# EAGLE design Clock Display (EAGLE 9.6.2)
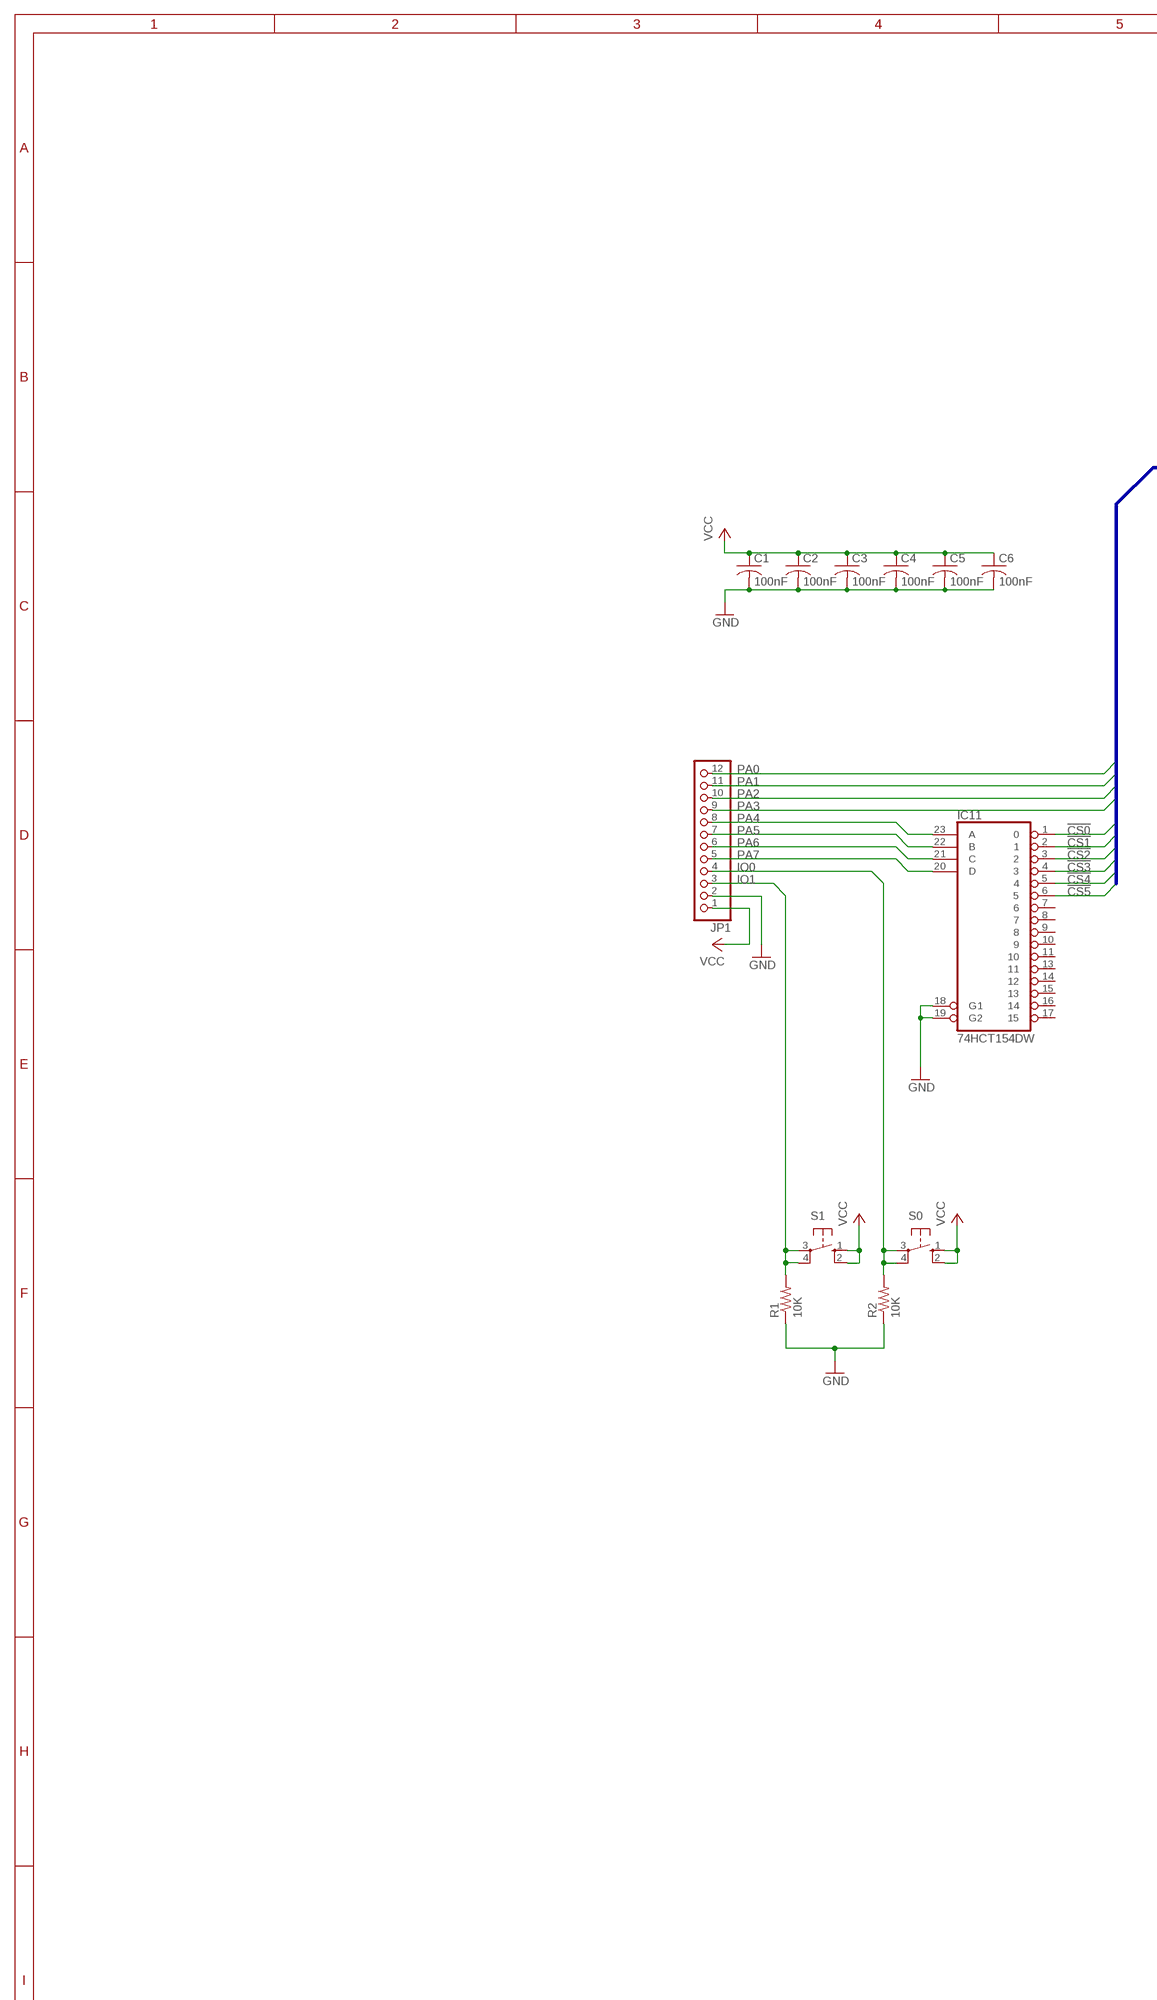
[diagram p0: schematic, sheet 1, part 1 of 2]
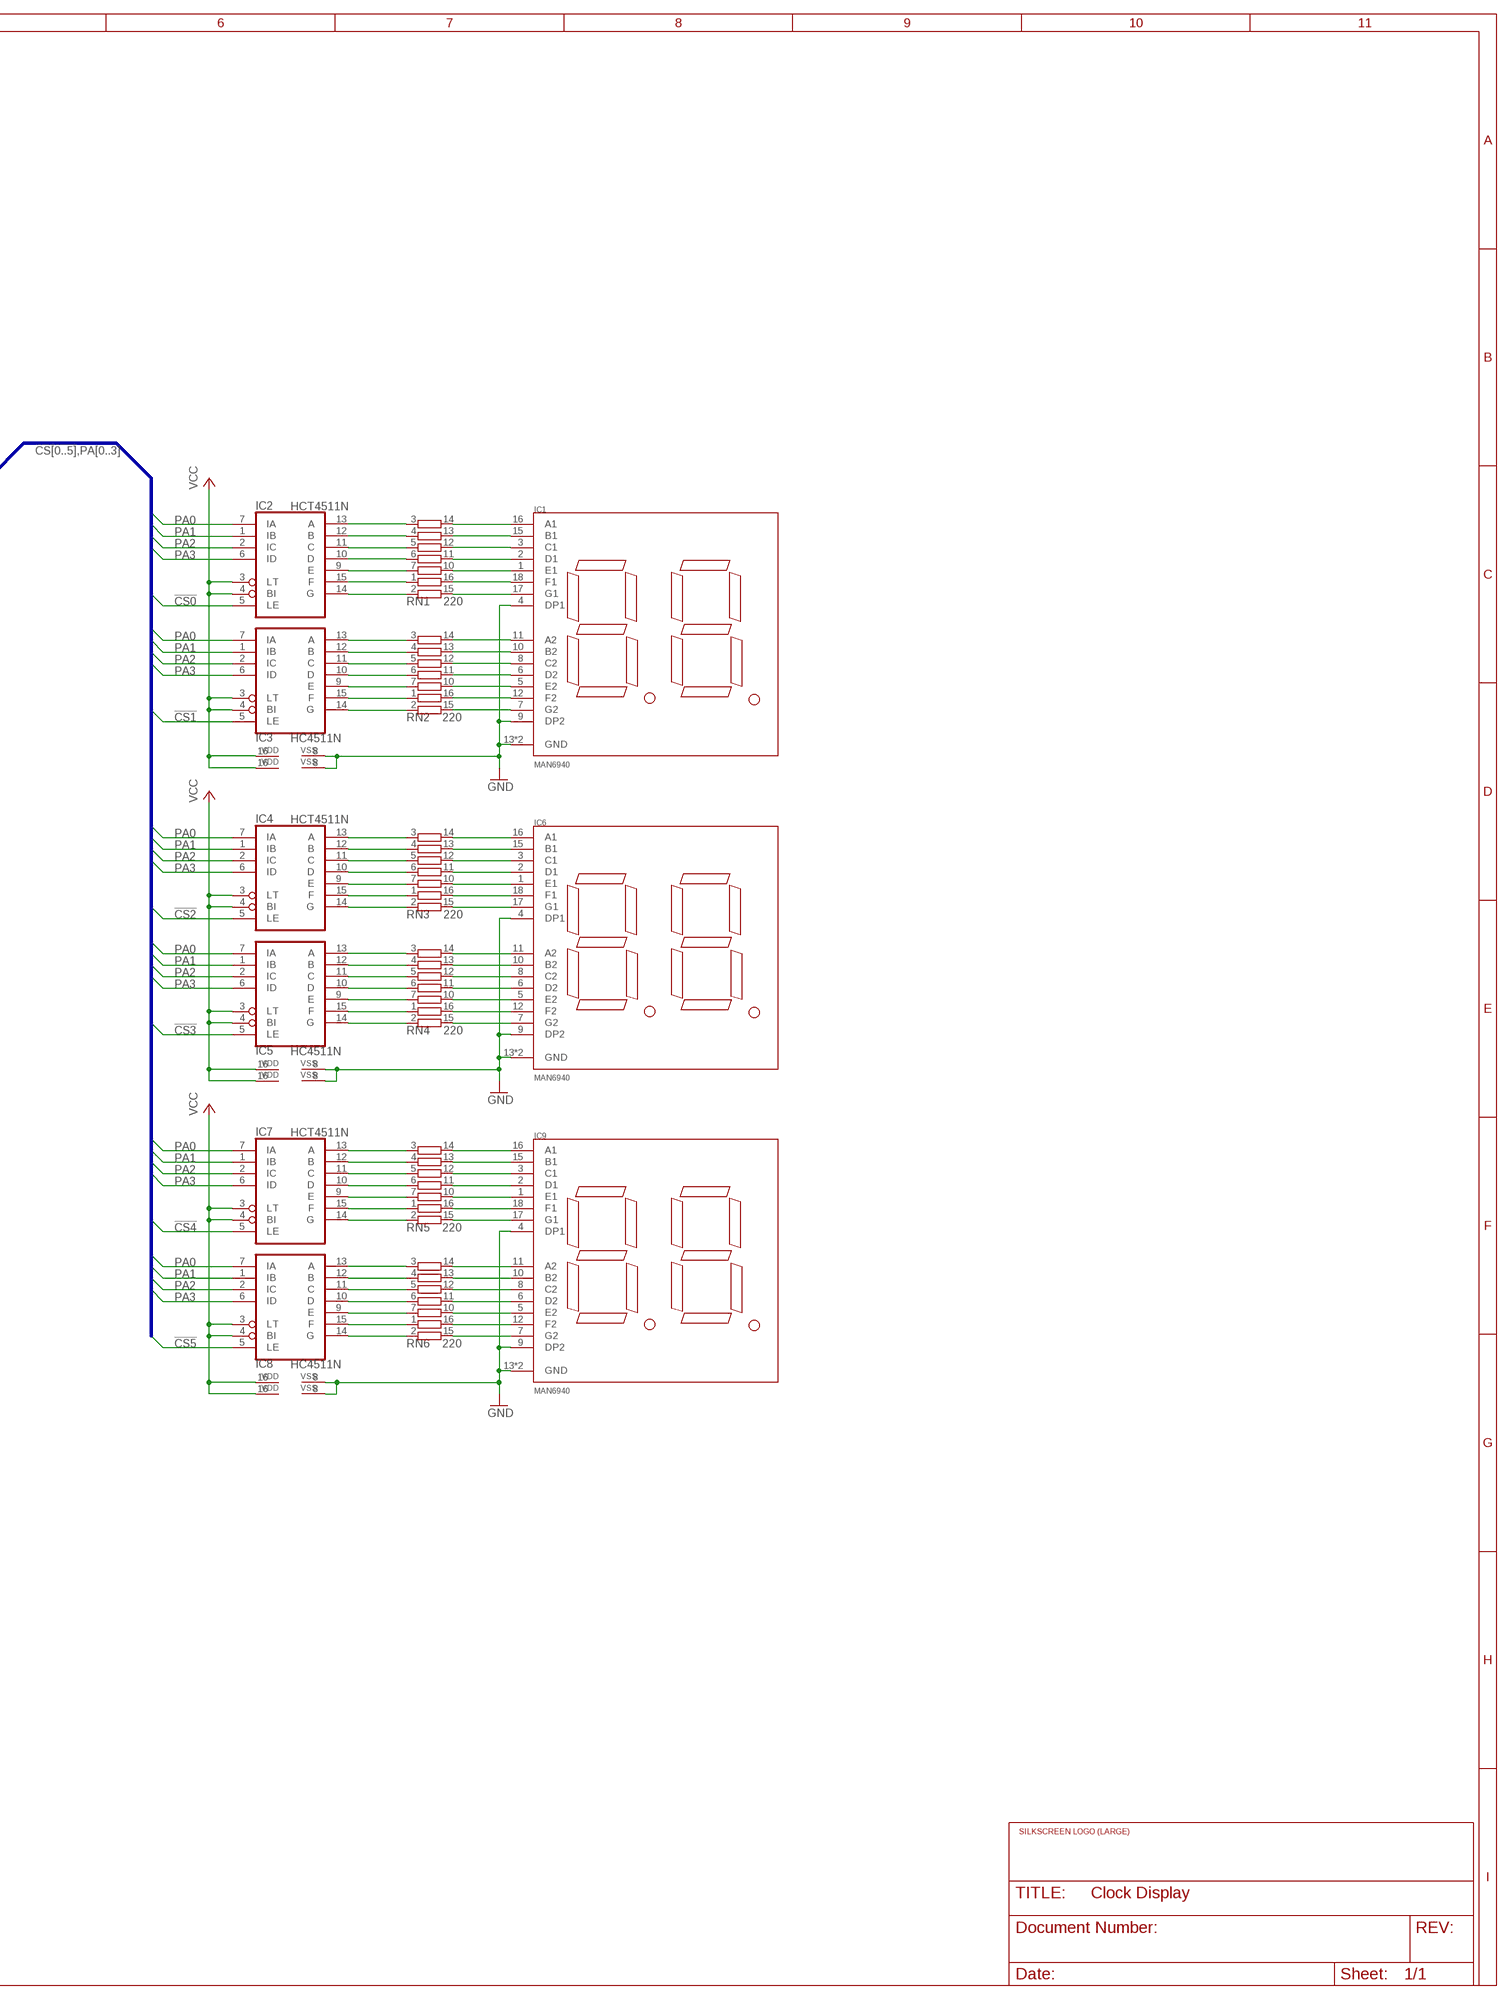
[diagram p1: schematic, sheet 1, part 2 of 2]

## Parts
C1  100nF  C-USC0805  [C0805]
C2  100nF  C-USC0805  [C0805]
C3  100nF  C-USC0805  [C0805]
C4  100nF  C-USC0805  [C0805]
C5  100nF  C-USC0805  [C0805]
C6  100nF  C-USC0805  [C0805]
IC1  MAN6940  [MAN6940]
IC2  HCT4511N  4511D  [SO16]
IC3  HC4511N  4511D  [SO16]
IC4  HCT4511N  4511D  [SO16]
IC5  HC4511N  4511D  [SO16]
IC6  MAN6940  [MAN6940]
IC7  HCT4511N  4511D  [SO16]
IC8  HC4511N  4511D  [SO16]
IC9  MAN6940  [MAN6940]
IC11  74HCT154DW  [SO24W]
JP1  PINHD-1X12-CB  [1X12-CB]
R1  10K  R-US_R0805  [R0805]
R2  10K  R-US_R0805  [R0805]
RN1  220  8R-NSOMC  [SOMC16]
RN2  220  8R-NSOMC  [SOMC16]
RN3  220  8R-NSOMC  [SOMC16]
RN4  220  8R-NSOMC  [SOMC16]
RN5  220  8R-NSOMC  [SOMC16]
RN6  220  8R-NSOMC  [SOMC16]
S0  10-XX  [B3F-10XX]
S1  10-XX  [B3F-10XX]
U$1  LOGO_LARGE  [LOGO_LARGE]

## Nets
!CS0: IC2.5(LE) IC11.1
!CS1: IC3.5(LE) IC11.2
!CS2: IC4.5(LE) IC11.3
!CS3: IC5.5(LE) IC11.4
!CS4: IC7.5(LE) IC11.5
!CS5: IC8.5(LE) IC11.6
GND: C1.2 C2.2 C3.2 C4.2 C5.2 C6.2 IC1.4(DP1) IC1.9(DP2) IC1.13(GND) IC1.14(GND) IC2.8(VSS) IC3.8(VSS) IC4.8(VSS) IC5.8(VSS) IC6.4(DP1) IC6.9(DP2) IC6.13(GND) IC6.14(GND) IC7.8(VSS) IC8.8(VSS) IC9.4(DP1) IC9.9(DP2) IC9.13(GND) IC9.14(GND) IC11.18(G1) IC11.19(G2) JP1.2 R1.1 R2.1
IO0: JP1.4 R2.2 S0.3(P) S0.4(P1)
IO1: JP1.3 R1.2 S1.3(P) S1.4(P1)
N$1: IC2.13(A) RN1.3
N$2: IC2.12(B) RN1.4
N$3: IC2.11(C) RN1.5
N$4: IC2.10(D) RN1.6
N$5: IC2.9(E) RN1.7
N$6: IC2.15(F) RN1.1
N$7: IC2.14(G) RN1.2
N$8: IC3.13(A) RN2.3
N$9: IC3.12(B) RN2.4
N$10: IC3.11(C) RN2.5
N$11: IC3.10(D) RN2.6
N$12: IC3.9(E) RN2.7
N$13: IC3.15(F) RN2.1
N$14: IC3.14(G) RN2.2
N$15: IC1.7(G2) RN2.15
N$16: IC1.12(F2) RN2.16
N$17: IC1.5(E2) RN2.10
N$18: IC1.6(D2) RN2.11
N$19: IC1.8(C2) RN2.12
N$20: IC1.10(B2) RN2.13
N$21: IC1.11(A2) RN2.14
N$22: IC1.17(G1) RN1.15
N$23: IC1.18(F1) RN1.16
N$24: IC1.1(E1) RN1.10
N$25: IC1.3(C1) RN1.12
N$26: IC1.2(D1) RN1.11
N$27: IC1.15(B1) RN1.13
N$28: IC1.16(A1) RN1.14
N$29: IC6.16(A1) RN3.14
N$30: IC6.15(B1) RN3.13
N$31: IC6.3(C1) RN3.12
N$32: IC6.2(D1) RN3.11
N$33: IC6.1(E1) RN3.10
N$34: IC6.18(F1) RN3.16
N$35: IC6.17(G1) RN3.15
N$36: IC6.11(A2) RN4.14
N$37: IC6.10(B2) RN4.13
N$38: IC6.8(C2) RN4.12
N$39: IC6.6(D2) RN4.11
N$40: IC6.5(E2) RN4.10
N$41: IC6.12(F2) RN4.16
N$42: IC6.7(G2) RN4.15
N$43: IC4.13(A) RN3.3
N$44: IC4.12(B) RN3.4
N$45: IC4.11(C) RN3.5
N$46: IC4.10(D) RN3.6
N$47: IC4.9(E) RN3.7
N$48: IC4.15(F) RN3.1
N$49: IC4.14(G) RN3.2
N$50: IC5.13(A) RN4.3
N$51: IC5.12(B) RN4.4
N$52: IC5.11(C) RN4.5
N$53: IC5.10(D) RN4.6
N$54: IC5.9(E) RN4.7
N$55: IC5.15(F) RN4.1
N$56: IC5.14(G) RN4.2
N$57: IC9.16(A1) RN5.14
N$58: IC9.15(B1) RN5.13
N$59: IC9.3(C1) RN5.12
N$60: IC9.2(D1) RN5.11
N$61: IC9.1(E1) RN5.10
N$62: IC9.18(F1) RN5.16
N$63: IC9.17(G1) RN5.15
N$64: IC9.11(A2) RN6.14
N$65: IC9.10(B2) RN6.13
N$66: IC9.8(C2) RN6.12
N$67: IC9.6(D2) RN6.11
N$68: IC9.5(E2) RN6.10
N$69: IC9.12(F2) RN6.16
N$70: IC9.7(G2) RN6.15
N$71: IC7.13(A) RN5.3
N$72: IC7.12(B) RN5.4
N$73: IC7.11(C) RN5.5
N$74: IC7.10(D) RN5.6
N$75: IC7.9(E) RN5.7
N$76: IC7.15(F) RN5.1
N$77: IC7.14(G) RN5.2
N$78: IC8.13(A) RN6.3
N$79: IC8.12(B) RN6.4
N$80: IC8.11(C) RN6.5
N$81: IC8.10(D) RN6.6
N$82: IC8.9(E) RN6.7
N$83: IC8.15(F) RN6.1
N$84: IC8.14(G) RN6.2
PA0: IC2.7(IA) IC3.7(IA) IC4.7(IA) IC5.7(IA) IC7.7(IA) IC8.7(IA) JP1.12
PA1: IC2.1(IB) IC3.1(IB) IC4.1(IB) IC5.1(IB) IC7.1(IB) IC8.1(IB) JP1.11
PA2: IC2.2(IC) IC3.2(IC) IC4.2(IC) IC5.2(IC) IC7.2(IC) IC8.2(IC) JP1.10
PA3: IC2.6(ID) IC3.6(ID) IC4.6(ID) IC5.6(ID) IC7.6(ID) IC8.6(ID) JP1.9
PA4: IC11.23(A) JP1.8
PA5: IC11.22(B) JP1.7
PA6: IC11.21(C) JP1.6
PA7: IC11.20(D) JP1.5
VCC: C1.1 C2.1 C3.1 C4.1 C5.1 C6.1 IC2.3(LT) IC2.4(BI) IC2.16(VDD) IC3.3(LT) IC3.4(BI) IC3.16(VDD) IC4.3(LT) IC4.4(BI) IC4.16(VDD) IC5.3(LT) IC5.4(BI) IC5.16(VDD) IC7.3(LT) IC7.4(BI) IC7.16(VDD) IC8.3(LT) IC8.4(BI) IC8.16(VDD) JP1.1 S0.1(S) S0.2(S1) S1.1(S) S1.2(S1)
Unconnected: IC11.7 IC11.8 IC11.9 IC11.10 IC11.11 IC11.13 IC11.14 IC11.15 IC11.16 IC11.17 RN1.8 RN1.9 RN2.8 RN2.9 RN3.8 RN3.9 RN4.8 RN4.9 RN5.8 RN5.9 RN6.8 RN6.9

## Buses
!CS[0..5],PA[0..3]

## Notes on the sheet
- RN1
- RN2
- RN3
- RN4
- RN5
- RN6

## Power pins joined to a net without a drawn wire
GND: IC11.12(GND)
VCC: IC11.24(VCC)

## Library data of the parts
C1-C6 = rcl:C-US: CAPACITOR, American symbol; SPICEPREFIX: C
IC1 IC6 IC9 = MAN6940:MAN6940: FAIRCHILD SEMICONDUCTOR: MAN6940 Double 7-Segment Display (Common Cathode)
IC2-IC5 IC7 IC8 = 45xx:4511: BCD to 7-segment LATCH/DECODER/DRIVER
IC11 = 74xx-eu:74*154: 4-line to 16-line data SELECTOR/MULTIPLEXER
JP1 = adafruit:PINHD-1X12: PIN HEADER
R1 R2 = rcl:R-US_: RESISTOR, American symbol; SPICEPREFIX: R
RN1-RN6 = resistor-dil:8R-N: DIL RESISTOR; OC_FARNELL: unknown; OC_NEWARK: unknown
S0 S1 = switch-omron:10-XX: OMRON SWITCH; MPN: B3F-1000; OC_FARNELL: 176432; OC_NEWARK: 36M3542
U$1 = Logo 2020:LOGO_LARGE

## Board
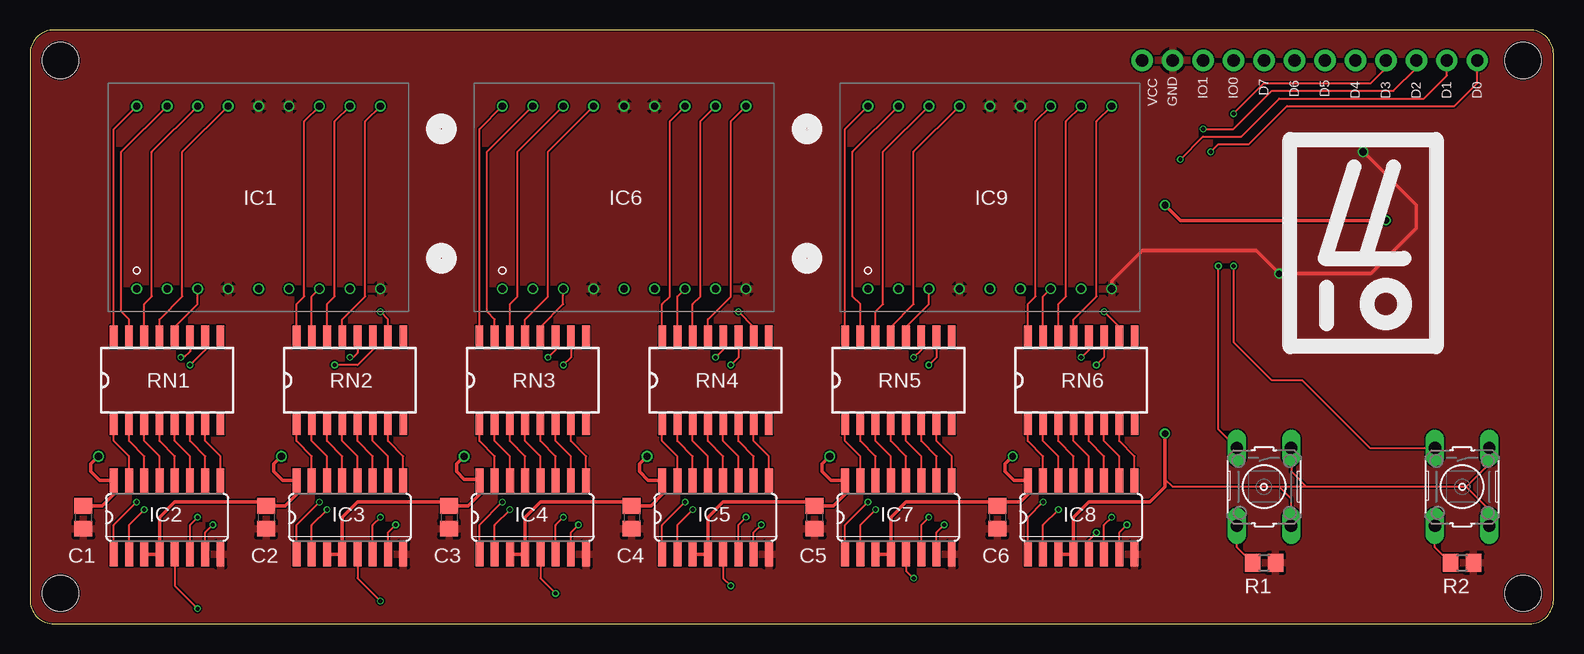
[diagram p2: board, top side]
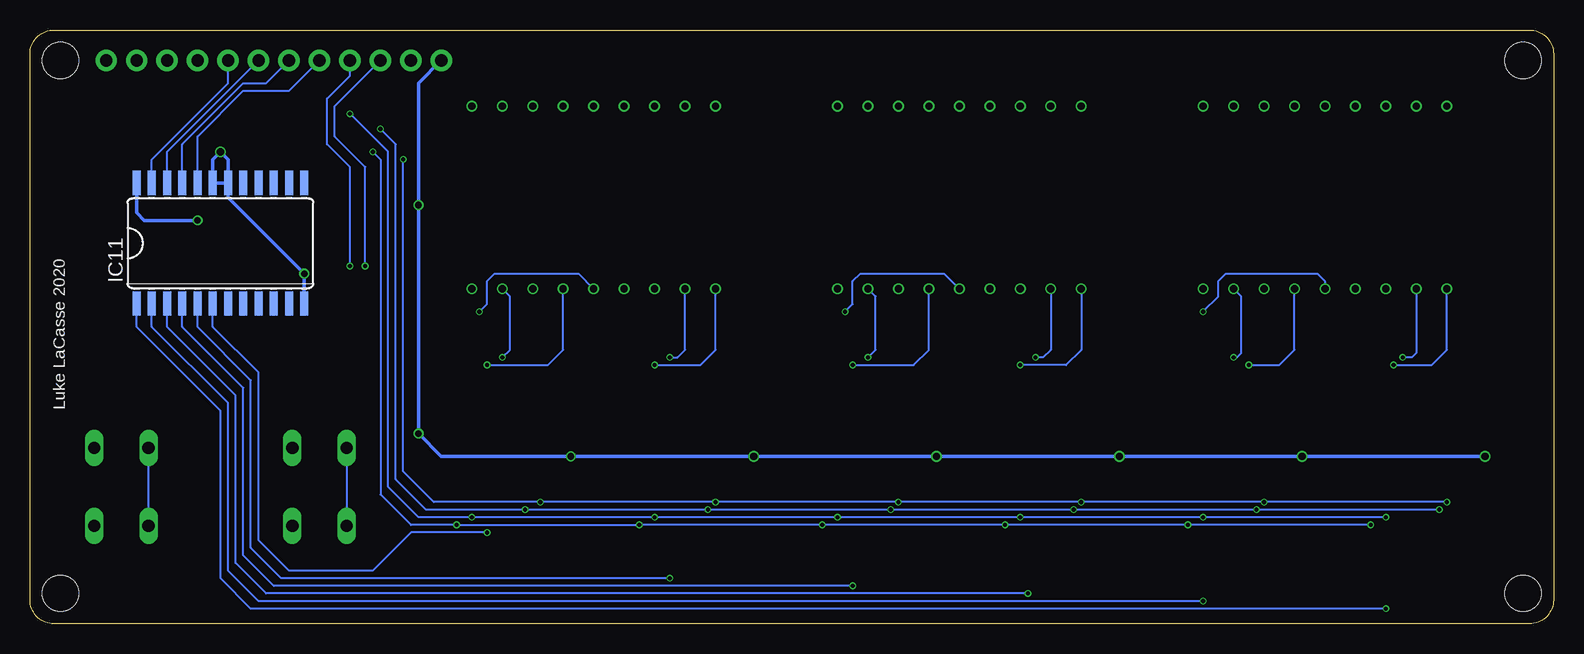
[diagram p3: board, bottom side, seen from below]

Size 127 x 49.53 mm. Coordinates in mm from the lower left corner, seen from the top.
Outline: 0,47.53 0,2 arc90 2,0 125,0 arc90 127,2 127,47.53 arc90 125,49.53 2,49.53 arc90 0,47.53
Copper layers (1*16): Top 0.035mm / dielectric 1.53mm / Bottom 0.035mm
Design rules "jlcpcb-2-layer(MINE)": minimum track width 5mil, minimum drill 0.2mm, track to track 5mil, track to pad 5mil, pad to pad 5mil, via to via 10mil, smd to smd 0mil, copper to edge 5mil, drill to drill 0.54mm, minimum pad ring 4mil, minimum via ring 4mil, stop-mask expansion 3mil, vias tented up to drill 100mil, thermal gap 10mil
Holes 3 mm at 2.54,46.99 2.54,2.54 124.46,2.54 124.46,46.99

### Footprints (pad centres in the part's own frame; a part is rotated, then mirrored left to right if it is on the bottom)
C0805 = smd 1.3 x 1.5: 1 -0.95,0; 2 0.95,0
MAN6940 = drill 0.6: 1 -10.16,-7.62; 2 -7.62,-7.62; 3 -5.08,-7.62; 4 -2.54,-7.62; 5 0,-7.62; 6 2.54,-7.62; 7 5.08,-7.62; 8 7.62,-7.62; 9 10.16,-7.62; 10 10.16,7.62; 11 7.62,7.62; 12 5.08,7.62; 13 2.54,7.62; 14 0,7.62; 15 -2.54,7.62; 16 -5.08,7.62; 17 -7.62,7.62; 18 -10.16,7.62
SO16 = smd 0.66 x 2.032: 1 -4.445,-3.073; 2 -3.175,-3.073; 3 -1.905,-3.073; 4 -0.635,-3.073; 5 0.635,-3.073; 6 1.905,-3.073; 7 3.175,-3.073; 8 4.445,-3.073; 9 4.445,3.073; 10 3.175,3.073; 11 1.905,3.073; 12 0.635,3.073; 13 -0.635,3.073; 14 -1.905,3.073; 15 -3.175,3.073; 16 -4.445,3.073
SO24W = smd 0.66 x 2.032: 1 -6.985,-5.029; 2 -5.715,-5.029; 3 -4.445,-5.029; 4 -3.175,-5.029; 5 -1.905,-5.029; 6 -0.635,-5.029; 7 0.635,-5.029; 8 1.905,-5.029; 9 3.175,-5.029; 10 4.445,-5.029; 11 5.715,-5.029; 12 6.985,-5.029; 13 6.985,5.029; 14 5.715,5.029; 15 4.445,5.029; 16 3.175,5.029; 17 1.905,5.029; 18 0.635,5.029; 19 -0.635,5.029; 20 -1.905,5.029; 21 -3.175,5.029; 22 -4.445,5.029; 23 -5.715,5.029; 24 -6.985,5.029
1X12-CB = drill 1.016 pad 1.778: 1 -13.97,0; 2 -11.43,0; 3 -8.89,0; 4 -6.35,0; 5 -3.81,0; 6 -1.27,0; 7 1.27,0; 8 3.81,0; 9 6.35,0; 10 8.89,0; 11 11.43,0; 12 13.97,0
R0805 = smd 1.3 x 1.5: 1 -0.95,0; 2 0.95,0
SOMC16 = smd 1.91 x 0.64: 1 -3.62,4.445; 2 -3.62,3.175; 3 -3.62,1.905; 4 -3.62,0.635; 5 -3.62,-0.635; 6 -3.62,-1.905; 7 -3.62,-3.175; 8 -3.62,-4.445; 9 3.62,-4.445; 10 3.62,-3.175; 11 3.62,-1.905; 12 3.62,-0.635; 13 3.62,0.635; 14 3.62,1.905; 15 3.62,3.175; 16 3.62,4.445
B3F-10XX = drill 1.016 long: 1 -3.251,2.261; 2 3.251,2.261; 3 -3.251,-2.261; 4 3.251,-2.261

### Placement (x,y rotation side)
C1  4.45,8.89 270 top
C2  19.68,8.89 270 top
C3  34.92,8.89 270 top
C4  50.16,8.89 270 top
C5  65.41,8.89 270 top
C6  80.64,8.89 270 top
IC1  19.05,35.56 0 top
IC2  11.43,8.89 0 top
IC3  26.67,8.89 0 top
IC4  41.91,8.89 0 top
IC5  57.15,8.89 0 top
IC6  49.53,35.56 0 top
IC7  72.39,8.89 0 top
IC8  87.63,8.89 0 top
IC9  80.01,35.56 0 top
IC11  111.12,31.75 0 bottom
JP1  106.68,46.99 0 top
R1  102.87,5.08 180 top
R2  119.38,5.08 180 top
RN1  11.43,20.32 90 top
RN2  26.67,20.32 90 top
RN3  41.91,20.32 90 top
RN4  57.15,20.32 90 top
RN5  72.39,20.32 90 top
RN6  87.63,20.32 90 top
S0  119.38,11.43 270 top
S1  102.87,11.43 270 top
U$1  111.12,31.75 0 top

### Tracks (layer width: path | path; a pad name or v marks a point on that pad's centre or on a via)
!CS0  (via drill 0.35)
  Top 0.152: IC2.5 12.06,3.17 v13.97,1.27
  Bottom 0.152: v13.97,1.27 108.58,1.27 111.12,3.81 111.12,17.78 118.11,24.77 IC11.1
!CS1  (via drill 0.35)
  Top 0.152: IC3.5 27.3,3.81 v29.21,1.91
  Bottom 0.152: v29.21,1.91 107.95,1.91 110.49,4.45 110.49,18.41 116.84,24.77 IC11.2
!CS2  (via drill 0.35)
  Top 0.152: IC4.5 42.55,3.81 v43.81,2.54
  Bottom 0.152: v43.81,2.54 107.31,2.54 109.86,5.08 109.86,19.05 115.57,24.77 IC11.3
!CS3  (via drill 0.35)
  Top 0.152: IC5.5 57.78,3.81 v58.42,3.17
  Bottom 0.152: IC11.4 114.3,24.77 109.22,19.68 109.22,5.71 106.68,3.17 v58.42,3.17
!CS4  (via drill 0.35)
  Top 0.152: IC7.5 73.03,4.45 v73.66,3.81
  Bottom 0.152: v73.66,3.81 106.05,3.81 108.58,6.35 108.58,20.32 113.03,24.77 IC11.5
!CS5  (via drill 0.35)
  Top 0.152: IC8.5 88.27,6.99 v88.9,7.62
  Bottom 0.152: v88.9,7.62 95.25,7.62 98.42,4.45 105.41,4.45 107.95,6.99 107.95,20.95 111.76,24.77 IC11.6
GND  (via drill 0.55, 0.6)
  Top 0.305: IC9.9 90.17,28.57 92.71,31.11 102.23,31.11 v104.14,29.21 111.76,29.21 115.57,33.02 115.57,34.92 v111.12,39.37
  Bottom 0.305: IC11.12 v104.14,29.21 110.49,35.56 IC11.18 | IC11.18 IC11.19 111.76,38.73 v111.12,39.37 110.49,38.73 IC11.18
  pour Top: -2.54,52.07 129.54,52.07 129.54,-2.54 -2.54,-2.54
IO0  (via drill 0.35)
  Top 0.152: v100.33,29.84 100.33,23.5 103.5,20.32 106.05,20.32 111.68,14.68 S0.3 | R2.2 117.12,6.39 S0.4
  Bottom 0.152: v100.33,29.84 100.33,38.1 102.23,40.01 102.23,43.81 100.33,45.72 JP1.4 | S0.4 S0.3
IO1  (via drill 0.35)
  Top 0.152: S1.3 99.06,16.23 v99.06,29.84 | R1.2 100.61,6.39 S1.4
  Bottom 0.152: v99.06,29.84 99.06,38.1 101.6,40.64 101.6,43.18 JP1.3 | S1.3 S1.4
N$1
  Top 0.152: IC2.13 10.79,13.97 9.53,15.24 RN1.3
N$2
  Top 0.152: IC2.12 12.06,13.97 10.79,15.24 RN1.4
N$3
  Top 0.152: IC2.11 13.34,13.97 12.06,15.24 RN1.5
N$4
  Top 0.152: IC2.10 14.61,13.97 13.34,15.24 RN1.6
N$5
  Top 0.152: IC2.9 15.88,13.97 14.61,15.24 RN1.7
N$6
  Top 0.152: IC2.15 8.26,13.97 6.99,15.24 RN1.1
N$7
  Top 0.152: IC2.14 9.53,13.97 8.26,15.24 RN1.2
N$8
  Top 0.152: IC3.13 26.04,13.97 24.77,15.24 RN2.3
N$9
  Top 0.152: IC3.12 27.3,13.97 26.04,15.24 RN2.4
N$10
  Top 0.152: IC3.11 28.57,13.97 27.3,15.24 RN2.5
N$11
  Top 0.152: IC3.10 29.84,13.97 28.57,15.24 RN2.6
N$12
  Top 0.152: IC3.9 31.11,13.97 29.84,15.24 RN2.7
N$13
  Top 0.152: IC3.15 23.5,13.97 22.23,15.24 RN2.1
N$14
  Top 0.152: IC3.14 24.77,13.97 23.5,15.24 RN2.2
N$15
  Top 0.152: RN2.15 23.5,27.3 IC1.7
N$16
  Top 0.152: RN2.16 22.23,26.67 22.86,27.3 22.86,41.91 IC1.12
N$17  (via drill 0.35)
  Top 0.152: RN2.10 29.84,25.4 v29.21,26.04
  Bottom 0.152: v29.21,26.04 27.94,27.3 27.94,28.57 27.3,29.21 19.68,29.21 19.05,28.57 IC1.5
N$18  (via drill 0.35)
  Top 0.152: RN2.11 28.57,23.18 28.64,23.11 28.64,22.92 27.3,21.59 v25.4,21.59
  Bottom 0.152: v25.4,21.59 22.86,21.59 21.59,22.86 IC1.6
N$19  (via drill 0.35)
  Top 0.152: RN2.12 27.3,22.61 26.92,22.23 v26.67,22.23
  Bottom 0.152: v26.67,22.23 26.42,22.23 26.04,22.61 26.04,27.3 IC1.8
N$20
  Top 0.152: RN2.13 26.04,25.4 27.94,27.3 27.94,41.91 IC1.10
N$21
  Top 0.152: RN2.14 24.77,26.67 25.4,27.3 25.4,41.91 IC1.11
N$22
  Top 0.152: RN1.15 8.26,25.4 7.62,26.04 7.62,39.37 IC1.17
N$23
  Top 0.152: RN1.16 6.99,41.27 IC1.18
N$24  (via drill 0.35)
  Top 0.152: RN1.10 14.61,22.86 v13.34,21.59
  Bottom 0.152: v13.34,21.59 10.16,21.59 8.89,22.86 IC1.1
N$25
  Top 0.152: RN1.12 12.06,24.77 13.97,26.67 IC1.3
N$26  (via drill 0.35)
  Top 0.152: RN1.11 13.34,22.73 12.83,22.23 v12.57,22.23
  Bottom 0.152: IC1.2 11.43,22.61 11.81,22.23 v12.57,22.23
N$27
  Top 0.152: RN1.13 10.79,25.4 12.7,27.3 12.7,39.37 IC1.15
N$28
  Top 0.152: RN1.14 9.53,26.67 10.16,27.3 10.16,39.37 IC1.16
N$29
  Top 0.152: RN3.14 40.01,26.67 40.64,27.3 40.64,39.37 IC6.16
N$30
  Top 0.152: RN3.13 41.27,25.4 43.18,27.3 43.18,39.37 IC6.15
N$31
  Top 0.152: RN3.12 42.55,24.77 44.45,26.67 IC6.3
N$32  (via drill 0.35)
  Top 0.152: RN3.11 43.81,22.86 v43.18,22.23
  Bottom 0.152: IC6.2 41.91,22.86 42.55,22.23 v43.18,22.23
N$33  (via drill 0.35)
  Top 0.152: RN3.10 45.09,22.23 v44.45,21.59
  Bottom 0.152: IC6.1 39.37,22.86 40.64,21.59 v44.45,21.59
N$34
  Top 0.152: RN3.16 37.47,41.27 IC6.18
N$35
  Top 0.152: RN3.15 38.73,25.4 38.1,26.04 38.1,39.37 IC6.17
N$36
  Top 0.152: RN4.14 55.24,26.67 55.88,27.3 55.88,41.91 IC6.11
N$37
  Top 0.152: RN4.13 56.52,25.4 58.42,27.3 58.42,41.91 IC6.10
N$38  (via drill 0.35)
  Top 0.152: RN4.12 57.78,22.86 v57.15,22.23
  Bottom 0.152: v57.15,22.23 56.52,22.86 56.52,27.3 IC6.8
N$39  (via drill 0.35)
  Top 0.152: RN4.11 59.05,22.23 v58.42,21.59
  Bottom 0.152: v58.42,21.59 53.34,21.59 52.07,22.86 IC6.6
N$40  (via drill 0.35)
  Top 0.152: RN4.10 60.33,24.77 v59.05,26.04
  Bottom 0.152: v59.05,26.04 58.42,26.67 58.42,28.57 57.78,29.21 50.8,29.21 IC6.5
N$41
  Top 0.152: RN4.16 52.7,26.67 53.34,27.3 53.34,41.91 IC6.12
N$42
  Top 0.152: RN4.15 53.98,27.3 IC6.7
N$43
  Top 0.152: IC4.13 41.27,13.97 40.01,15.24 RN3.3
N$44
  Top 0.152: IC4.12 42.55,13.97 41.27,15.24 RN3.4
N$45
  Top 0.152: IC4.11 43.81,13.97 42.55,15.24 RN3.5
N$46
  Top 0.152: IC4.10 45.09,13.97 43.81,15.24 RN3.6
N$47
  Top 0.152: IC4.9 46.35,13.97 45.09,15.24 RN3.7
N$48
  Top 0.152: IC4.15 38.73,13.97 37.47,15.24 RN3.1
N$49
  Top 0.152: IC4.14 40.01,13.97 38.73,15.24 RN3.2
N$50
  Top 0.152: IC5.13 56.52,13.97 55.24,15.24 RN4.3
N$51
  Top 0.152: IC5.12 57.78,13.97 56.52,15.24 RN4.4
N$52
  Top 0.152: IC5.11 59.05,13.97 57.78,15.24 RN4.5
N$53
  Top 0.152: IC5.10 60.33,13.97 59.05,15.24 RN4.6
N$54
  Top 0.152: IC5.9 61.59,13.97 60.33,15.24 RN4.7
N$55
  Top 0.152: IC5.15 53.98,13.97 52.7,15.24 RN4.1
N$56
  Top 0.152: IC5.14 55.24,13.97 53.98,15.24 RN4.2
N$57
  Top 0.152: RN5.14 70.48,26.04 71.12,26.67 71.12,39.37 IC9.16
N$58
  Top 0.152: RN5.13 71.75,24.77 73.66,26.67 73.66,39.37 IC9.15
N$59
  Top 0.152: RN5.12 73.03,24.77 74.93,26.67 IC9.3
N$60  (via drill 0.35)
  Top 0.152: RN5.11 74.3,22.86 v73.66,22.23
  Bottom 0.152: v73.66,22.23 73.03,22.23 72.39,22.86 IC9.2
N$61  (via drill 0.35)
  Top 0.152: RN5.10 75.56,22.23 v74.93,21.59
  Bottom 0.152: v74.93,21.59 71.12,21.59 69.85,22.86 IC9.1
N$62
  Top 0.152: RN5.16 67.94,41.27 IC9.18
N$63
  Top 0.152: RN5.15 69.22,26.67 68.58,27.3 68.58,39.37 IC9.17
N$64
  Top 0.152: RN6.14 85.72,26.67 86.36,27.3 86.36,41.91 IC9.11
N$65
  Top 0.152: RN6.13 87,25.4 88.9,27.3 88.9,41.91 IC9.10
N$66  (via drill 0.35)
  Top 0.152: RN6.12 88.27,22.86 v87.63,22.23
  Bottom 0.152: v87.63,22.23 87,22.86 87,27.3 IC9.8
N$67  (via drill 0.35)
  Top 0.152: RN6.11 89.53,22.23 v88.9,21.59
  Bottom 0.152: IC9.6 82.55,22.86 83.82,21.59 v88.9,21.59
N$68  (via drill 0.35)
  Top 0.152: RN6.10 90.81,24.77 v89.53,26.04
  Bottom 0.152: v89.53,26.04 88.9,26.67 88.9,28.57 88.27,29.21 81.28,29.21 IC9.5
N$69
  Top 0.152: RN6.16 83.19,26.67 83.82,27.3 83.82,41.91 IC9.12
N$70
  Top 0.152: RN6.15 84.45,27.3 IC9.7
N$71
  Top 0.152: IC7.13 71.75,13.97 70.48,15.24 RN5.3
N$72
  Top 0.152: IC7.12 73.03,13.97 71.75,15.24 RN5.4
N$73
  Top 0.152: IC7.11 74.3,13.97 73.03,15.24 RN5.5
N$74
  Top 0.152: IC7.10 75.56,13.97 74.3,15.24 RN5.6
N$75
  Top 0.152: IC7.9 76.83,13.97 75.56,15.24 RN5.7
N$76
  Top 0.152: IC7.15 69.22,13.97 67.94,15.24 RN5.1
N$77
  Top 0.152: IC7.14 70.48,13.97 69.22,15.24 RN5.2
N$78
  Top 0.152: IC8.13 87,13.97 85.72,15.24 RN6.3
N$79
  Top 0.152: IC8.12 88.27,13.97 87,15.24 RN6.4
N$80
  Top 0.152: IC8.11 89.53,13.97 88.27,15.24 RN6.5
N$81
  Top 0.152: IC8.10 90.81,13.97 89.53,15.24 RN6.6
N$82
  Top 0.152: IC8.9 92.08,13.97 90.81,15.24 RN6.7
N$83
  Top 0.152: IC8.15 84.45,13.97 83.19,15.24 RN6.1
N$84
  Top 0.152: IC8.14 85.72,13.97 84.45,15.24 RN6.2
PA0  (via drill 0.35)
  Top 0.152: IC2.7 14.61,7.62 v15.24,8.26 | IC3.7 29.84,7.62 v30.48,8.26 | IC4.7 45.09,7.62 v45.72,8.26 | IC5.7 60.33,7.62 v60.96,8.26 | IC7.7 75.56,7.62 v76.2,8.26 | IC8.7 90.81,7.62 v91.44,8.26 | v98.42,39.37 99.06,40.01 101.6,40.01 104.78,43.18 118.75,43.18 120.65,45.09 JP1.12
  Bottom 0.152: v15.24,8.26 v30.48,8.26 v45.72,8.26 v60.96,8.26 v76.2,8.26 v91.44,8.26 95.25,8.26 97.79,10.79 97.79,38.73 v98.42,39.37
PA1  (via drill 0.35)
  Top 0.152: IC8.1 83.19,8.89 v84.45,10.16 | IC2.1 6.99,8.26 v8.89,10.16 | IC3.1 22.23,8.26 v24.13,10.16 | IC4.1 37.47,8.26 v39.37,10.16 | IC5.1 52.7,8.26 v54.61,10.16 | IC7.1 67.94,8.26 v69.85,10.16 | v95.89,38.73 97.79,40.64 100.97,40.64 104.14,43.81 116.2,43.81 118.11,45.72 JP1.11
  Bottom 0.152: v8.89,10.16 v24.13,10.16 v39.37,10.16 v54.61,10.16 v69.85,10.16 v84.45,10.16 93.34,10.16 95.89,12.7 v95.89,38.73
PA2  (via drill 0.35)
  Top 0.152: IC8.2 84.45,8.26 v85.72,9.53 | IC7.2 69.22,8.26 v70.48,9.53 | IC5.2 53.98,8.26 v55.24,9.53 | IC4.2 38.73,8.26 v40.01,9.53 | IC3.2 23.5,8.26 v24.77,9.53 | IC2.2 8.26,8.26 v9.53,9.53 | v97.79,41.27 100.33,41.27 103.5,44.45 113.67,44.45 115.57,46.35 JP1.10
  Bottom 0.152: v9.53,9.53 v24.77,9.53 v40.01,9.53 v55.24,9.53 v70.48,9.53 v85.72,9.53 93.98,9.53 96.52,12.06 96.52,40.01 v97.79,41.27
PA3  (via drill 0.35)
  Top 0.152: IC8.6 89.53,8.26 v90.17,8.89 | IC2.6 13.34,8.26 v13.97,8.89 | IC3.6 28.57,8.26 v29.21,8.89 | IC4.6 43.81,8.26 v44.45,8.89 | IC5.6 59.05,8.26 v59.69,8.89 | IC7.6 74.3,8.26 v74.93,8.89 | v100.33,42.55 102.87,45.09 111.76,45.09 113.03,46.35 JP1.9
  Bottom 0.152: v13.97,8.89 v29.21,8.89 v44.45,8.89 v59.69,8.89 v74.93,8.89 v90.17,8.89 94.61,8.89 97.16,11.43 97.16,39.37 v100.33,42.55
PA4
  Bottom 0.152: IC11.23 116.84,38.73 110.49,45.09 JP1.8
PA5
  Bottom 0.152: IC11.22 115.57,39.37 JP1.7
PA6
  Bottom 0.152: IC11.21 114.3,40.01 109.22,45.09 107.31,45.09 JP1.6
PA7
  Bottom 0.152: IC11.20 113.03,40.64 109.22,44.45 105.41,44.45 JP1.5
VCC  (via drill 0.55, 0.6)
  Top 0.152: 119.74,11.43 106.4,11.43 | 106.4,11.43 104.14,11.43 | 104.14,11.43 95.25,11.43 94.61,12.06 | S0.1 121.64,13.34 119.74,11.43 | S0.2 121.64,9.53 119.74,11.43 | S1.1 105.13,12.7 106.4,11.43 | S1.2 105.13,10.44 104.14,11.43
  Top 0.305: C6.1 80.64,10.16 | IC2.3 IC2.4 10.79,8.89 12.06,10.16 19.68,10.16 C2.1 21.27,9.84 22.23,10.79 IC3.16 21.06,11.96 20.32,12.7 20.32,13.34 v20.95,13.97 | IC3.3 IC3.4 26.04,8.89 27.3,10.16 34.6,10.16 C3.1 36.51,9.84 37.47,10.79 IC4.16 37.47,12.06 36.2,12.06 35.56,12.7 35.56,13.34 v36.2,13.97 | IC4.3 IC4.4 41.27,8.89 42.55,10.16 50.16,10.16 C4.1 51.75,9.84 52.7,10.79 IC5.16 51.54,11.96 50.8,12.7 50.8,13.34 v51.44,13.97 | IC5.3 IC5.4 56.52,8.89 57.78,10.16 65.41,10.16 C5.1 66.99,9.84 67.94,10.79 IC7.16 66.78,11.96 66.04,12.7 66.04,13.34 v66.67,13.97 | IC7.3 IC7.4 71.75,8.89 73.03,10.16 80.64,10.16 | v94.61,15.88 94.61,12.06 94.61,11.43 93.34,10.16 88.27,10.16 87,8.89 IC8.4 IC8.3 | v94.61,34.92 95.89,33.66 v113.03,33.66 | C1.1 6.03,9.84 6.99,10.79 IC2.16 5.82,11.96 5.08,12.7 5.08,13.34 v5.71,13.97 | 80.64,10.16 82.55,10.16 83.19,10.79 IC8.16 82.02,11.96 81.28,12.7 81.28,13.34 v81.92,13.97
  Bottom 0.305: v113.03,33.66 117.47,33.66 118.11,34.29 IC11.24 | JP1.1 94.61,45.09 v94.61,34.92 v94.61,15.88 92.71,13.97 v81.92,13.97 v66.67,13.97 v51.44,13.97 v36.2,13.97 v20.95,13.97 v5.71,13.97

### Text on the board
tPlace: IO1 | IO0 | D7 | D6 | D5 | D4 | D3 | D2 | D1 | D0 | VCC | GND
bPlace: Luke LaCasse 2020